# EAGLE design BRD1001-001-010-320 - Clock (EAGLE 9.4.2)
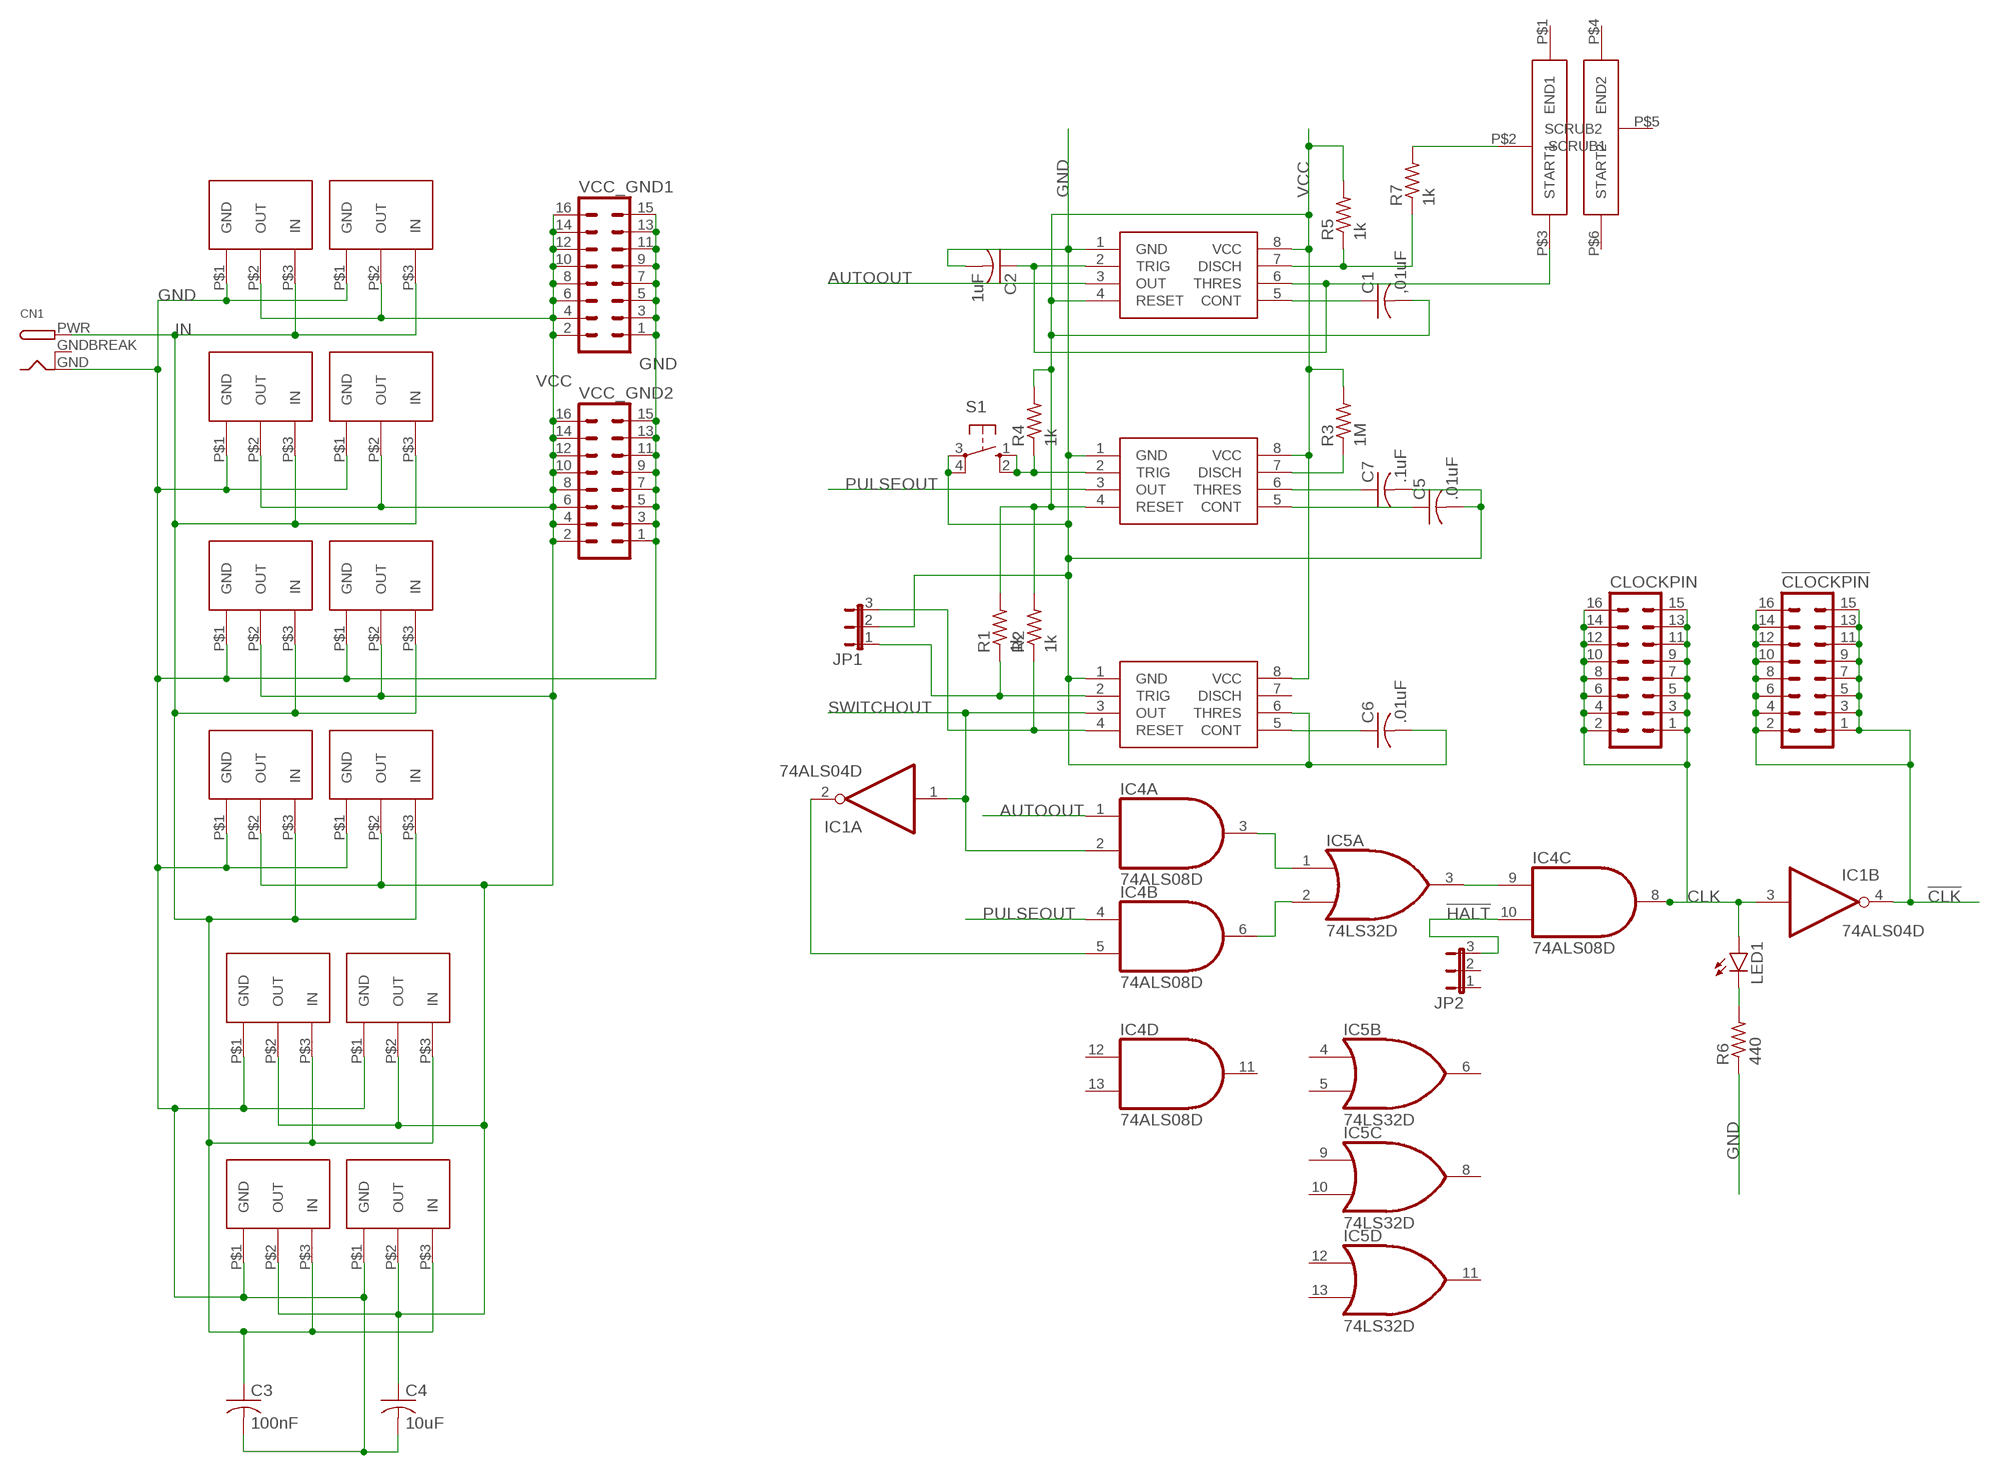
[diagram p0: schematic, sheet 1]

## Parts
!CLOCKPIN  ML16  [ML16]
AUTO  NA555  [SO8]
C1  ,01uF  C-US025-024X044  [C025-024X044]
C2  1uF  C-US025-024X044  [C025-024X044]
C3  100nF  C-US025-024X044  [C025-024X044]
C4  10uF  C-US025-024X044  [C025-024X044]
C5  .01uF  C-US025-024X044  [C025-024X044]
C6  .01uF  C-US025-024X044  [C025-024X044]
C7  .1uF  C-US025-024X044  [C025-024X044]
CLOCKPIN  ML16  [ML16]
CN1  DCBARRELPTH  [DCJACK_2MM_PTH]
IC1  74ALS04D  [SO14]
IC4  74ALS08D  [SO14]
IC5  74LS32D  [SO14]
JP1  JP2E  [JP2]
JP2  JP2E  [JP2]
LED1  LED5MM  [LED5MM]
PULSE  NA555  [SO8]
R1  1k  R-US_0204/2V  [0204V]
R2  1k  R-US_0204/2V  [0204V]
R3  1M  R-US_0204/2V  [0204V]
R4  1k  R-US_0204/2V  [0204V]
R5  1k  R-US_0204/2V  [0204V]
R6  440  R-US_0204/2V  [0204V]
R7  1k  R-US_0204/2V  [0204V]
S1  40-XX  [B3F-40XX]
SWITCH  NA555  [SO8]
U$1  3310H-001-105L  [3310H-001-105L]
U$2  LD1117S33TR  [AZ1117E]
U$3  LD1117S33TR  [AZ1117E]
U$4  LD1117S33TR  [AZ1117E]
U$5  LD1117S33TR  [AZ1117E]
U$6  LD1117S33TR  [AZ1117E]
U$7  LD1117S33TR  [AZ1117E]
U$8  LD1117S33TR  [AZ1117E]
U$9  LD1117S33TR  [AZ1117E]
U$10  LD1117S33TR  [AZ1117E]
U$11  LD1117S33TR  [AZ1117E]
U$12  LD1117S33TR  [AZ1117E]
U$13  LD1117S33TR  [AZ1117E]
VCC_GND1  ML16  [ML16]
VCC_GND2  ML16  [ML16]

## Nets
!CLK: !CLOCKPIN.1 !CLOCKPIN.2 !CLOCKPIN.3 !CLOCKPIN.4 !CLOCKPIN.5 !CLOCKPIN.6 !CLOCKPIN.7 !CLOCKPIN.8 !CLOCKPIN.9 !CLOCKPIN.10 !CLOCKPIN.11 !CLOCKPIN.12 !CLOCKPIN.13 !CLOCKPIN.14 !CLOCKPIN.15 !CLOCKPIN.16 IC1.4(B:O)
!HALT: IC4.10(C:I1) JP2.3
AUTOOUT: AUTO.3(OUT) IC4.1(A:I0)
CLK: CLOCKPIN.1 CLOCKPIN.2 CLOCKPIN.3 CLOCKPIN.4 CLOCKPIN.5 CLOCKPIN.6 CLOCKPIN.7 CLOCKPIN.8 CLOCKPIN.9 CLOCKPIN.10 CLOCKPIN.11 CLOCKPIN.12 CLOCKPIN.13 CLOCKPIN.14 CLOCKPIN.15 CLOCKPIN.16 IC1.3(B:I) IC4.8(C:O) LED1.A
GND [power]: AUTO.1(GND) C2.2 C3.2 C4.2 C5.2 C6.2 C7.2 CN1.GND JP1.2 PULSE.1(GND) R6.1 S1.3(P) S1.4(P1) SWITCH.1(GND) SWITCH.6(THRES) U$2.P$1(GND) U$3.P$1(GND) U$4.P$1(GND) U$5.P$1(GND) U$6.P$1(GND) U$7.P$1(GND) U$8.P$1(GND) U$9.P$1(GND) U$10.P$1(GND) U$11.P$1(GND) U$12.P$1(GND) U$13.P$1(GND) VCC_GND1.1 VCC_GND1.3 VCC_GND1.5 VCC_GND1.7 VCC_GND1.9 VCC_GND1.11 VCC_GND1.13 VCC_GND1.15 VCC_GND2.1 VCC_GND2.3 VCC_GND2.5 VCC_GND2.7 VCC_GND2.9 VCC_GND2.11 VCC_GND2.13 VCC_GND2.15
IN [power]: C3.1 CN1.PWR U$2.P$3(IN) U$3.P$3(IN) U$4.P$3(IN) U$5.P$3(IN) U$6.P$3(IN) U$7.P$3(IN) U$8.P$3(IN) U$9.P$3(IN) U$10.P$3(IN) U$11.P$3(IN) U$12.P$3(IN) U$13.P$3(IN)
N$1: AUTO.2(TRIG) AUTO.6(THRES) C2.1 U$1.P$3(START1)
N$3: LED1.K(C) R6.2
N$4: AUTO.5(CONT) C1.1
N$5: R7.2 U$1.P$2(SCRUB1)
N$6: AUTO.7(DISCH) R5.1 R7.1
N$7: PULSE.2(TRIG) R4.1 S1.1(S) S1.2(S1)
N$8: C7.1 PULSE.6(THRES)
N$9: C5.1 PULSE.5(CONT)
N$10: PULSE.7(DISCH) R3.1
N$11: C6.1 SWITCH.5(CONT)
N$13: JP1.3 R2.1 SWITCH.4(RESET)
N$14: JP1.1 R1.1 SWITCH.2(TRIG)
N$15: IC1.2(A:O) IC4.5(B:I1)
N$16: IC4.3(A:O) IC5.1(A:I0)
N$17: IC4.6(B:O) IC5.2(A:I1)
N$22: IC4.9(C:I0) IC5.3(A:O)
PULSEOUT: IC4.4(B:I0) PULSE.3(OUT)
SWITCHOUT: IC1.1(A:I) IC4.2(A:I1) SWITCH.3(OUT)
VCC [power]: AUTO.4(RESET) AUTO.8(VCC) C1.2 C4.1 PULSE.4(RESET) PULSE.8(VCC) R1.2 R2.2 R3.2 R4.2 R5.2 SWITCH.8(VCC) U$2.P$2(OUT) U$3.P$2(OUT) U$4.P$2(OUT) U$5.P$2(OUT) U$6.P$2(OUT) U$7.P$2(OUT) U$8.P$2(OUT) U$9.P$2(OUT) U$10.P$2(OUT) U$11.P$2(OUT) U$12.P$2(OUT) U$13.P$2(OUT) VCC_GND1.2 VCC_GND1.4 VCC_GND1.6 VCC_GND1.8 VCC_GND1.10 VCC_GND1.12 VCC_GND1.14 VCC_GND1.16 VCC_GND2.2 VCC_GND2.4 VCC_GND2.6 VCC_GND2.8 VCC_GND2.10 VCC_GND2.12 VCC_GND2.14 VCC_GND2.16
Unconnected: IC1.5(C:I) IC1.6(C:O) IC1.8(D:O) IC1.9(D:I) IC1.10(E:O) IC1.11(E:I) IC1.12(F:O) IC1.13(F:I) IC4.11(D:O) IC4.12(D:I0) IC4.13(D:I1) IC5.4(B:I0) IC5.5(B:I1) IC5.6(B:O) IC5.8(C:O) IC5.9(C:I0) IC5.10(C:I1) IC5.11(D:O) IC5.12(D:I0) IC5.13(D:I1) JP2.1 JP2.2 SWITCH.7(DISCH) U$1.P$1(END1) U$1.P$4(END2) U$1.P$5(SCRUB2) U$1.P$6(START2)

## Power pins joined to a net without a drawn wire
GND: IC1.7(P:GND) IC4.7(P:GND) IC5.7(P:GND)
GNDBREAK: CN1.GNDBREAK
VCC: IC1.14(P:VCC) IC4.14(P:VCC) IC5.14(P:VCC)

## Library data of the parts
!CLOCKPIN CLOCKPIN VCC_GND1 VCC_GND2 = con-harting-ml:ML16: HARTING; OC_FARNELL: unknown; OC_NEWARK: unknown
AUTO PULSE SWITCH = 16bit:NA555
C1-C7 = rcl:C-US: CAPACITOR, American symbol; SPICEPREFIX: C
CN1 = adafruit:DCBARREL: 2.0mm DC Barrel Jack DCJACK_2MM_PTH - Through Hole Jack (4UConnector: 05537)
IC1 = 74xx-us:74*04: Hex INVERTER
IC4 = 74xx-us:74*08: Quad 2-input AND gate
IC5 = 74xx-us:74*32: Quad 2-input OR gate
JP1 JP2 = jumper:JP2E: JUMPER
LED1 = led:LED: LED OSRAM: - CHIPLED LG R971, LG N971, LY N971, LG Q971, LY Q971, LO R971, LY R971 LH N974, LH R974 LS Q976, LO Q976, LY Q976 LO Q996 - Hyper CHIPLED LW Q18S LB Q993, LB Q99A, LB R99A - SideLED LS A670, LO A670, LY A670, LG A670, LP A670 LB A673, LV A673, LT A673, LW A673 LH A674 LY A675 LS A676, LA A676, LO A676, LY A676, LW A676 LS A679, LY A679, LG A679 - Hyper Micro SIDELED® LS Y876, LA Y876, LO Y876, LY Y876 LT Y87S - SmartLED LW L88C, LW L88S LB L89C, LB L89S, LG L890 LS L89K, LO L89K, LY L89K LS L896, LA L896, LO L896, LY L896 - TOPLED LS T670, LO T670, LY T670, LG T670, LP T670 LSG T670, LSP T670, LSY T670, LOP T670, LYG T670 LG T671, LOG T671, LSG T671 LB T673, LV T673, LT T673, LW T673 LH T674 LS T676, LA T676, LO T676, LY T676, LB T676, LH T676, LSB T676, LW T676 LB T67C, LV T67C, LT T67C, LS T67K, LO T67K, LY T67K, LW E67C LS E67B, LA E67B, LO E67B, LY E67B, LB E67C, LV E67C, LT E67C LW T67C LS T679, LY T679, LG T679 LS T770, LO T770, LY T770, LG T770, LP T770 LB T773, LV T773, LT T773, LW T773 LH T774 LS E675, LA E675, LY E675, LS T675 LS T776, LA T776, LO T776, LY T776, LB T776 LHGB T686 LT T68C, LB T68C - Hyper Mini TOPLED® LB M676 - Mini TOPLED Santana® LG M470 LS M47K, LO M47K, LY M47K Source: http://www.osram.convergy.de LUXEON: - LUMILED® LXK2-PW12-R00, LXK2-PW12-S00, LXK2-PW14-U00, LXK2-PW14-V00 LXK2-PM12-R00, LXK2-PM12-S00, LXK2-PM14-U00 LXK2-PE12-Q00, LXK2-PE12-R00, LXK2-PE12-S00, LXK2-PE14-T00, LXK2-PE14-U00 LXK2-PB12-K00, LXK2-PB12-L00, LXK2-PB12-M00, LXK2-PB14-N00, LXK2-PB14-P00, LXK2-PB14-Q00 LXK2-PR12-L00, LXK2-PR12-M00, LXK2-PR14-Q00, LXK2-PR14-R00 LXK2-PD12-Q00, LXK2-PD12-R00, LXK2-PD12-S00 LXK2-PH12-R00, LXK2-PH12-S00 LXK2-PL12-P00, LXK2-PL12-Q00, LXK2-PL12-R00 Source: www.luxeon.com KINGBRIGHT: KA-3528ASYC Source: www.kingbright.com
R1-R7 = rcl:R-US_: RESISTOR, American symbol; SPICEPREFIX: R
S1 = switch-omron:40-XX: OMRON SWITCH; MF: OMRON COMPONENTS USA; MPN: B3F-4000; OC_FARNELL: 176434; OC_NEWARK: 36K3105
U$1 = 16bit:3310H-001-105L
U$2-U$13 = P1001-001-310 - Eagle Library:LD1117S33TR

## Net classes
1 power: width 1.219 mm

## Board
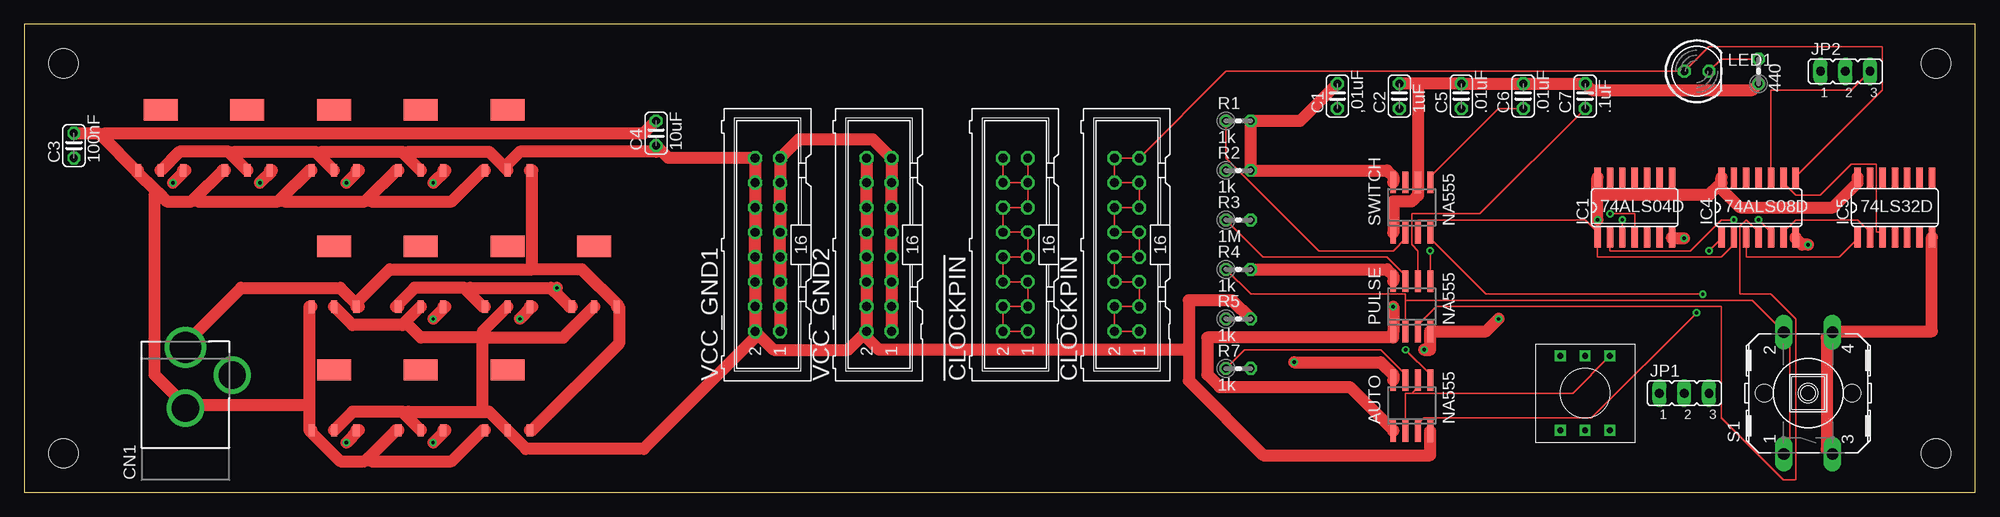
[diagram p1: board, top side]
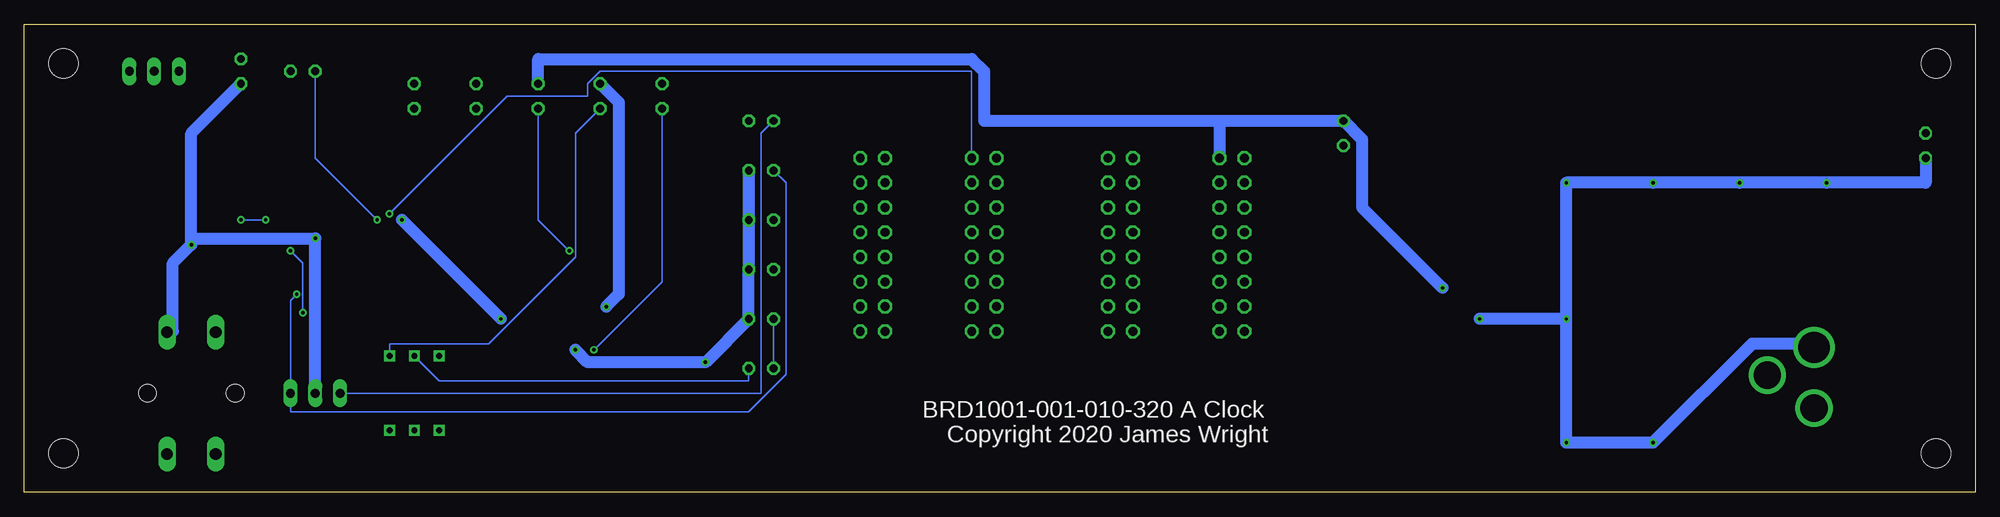
[diagram p2: board, bottom side, seen from below]

Size 200 x 48 mm. Coordinates in mm from the lower left corner, seen from the top.
Outline: 0,0 200,0 200,48 0,48 0,0
Copper layers (1*16): Top 0.035mm / dielectric 1.5mm / Bottom 0.035mm
Design rules "default": minimum track width 6mil, minimum drill 0.35mm, track to track 6mil, track to pad 6mil, pad to pad 6mil, via to via 6mil, smd to smd 6mil, copper to edge 40mil, drill to drill 6mil, minimum pad ring 10mil, minimum via ring 8mil, stop-mask expansion 4mil, vias tented up to drill 0mil, thermal gap 10mil
Holes 3 mm at 4,4 196,44 4,44 196,4

### Footprints (pad centres in the part's own frame; a part is rotated, then mirrored left to right if it is on the bottom)
ML16 = drill 0.914 octagon: 1 -8.89,-1.27; 2 -8.89,1.27; 3 -6.35,-1.27; 4 -6.35,1.27; 5 -3.81,-1.27; 6 -3.81,1.27; 7 -1.27,-1.27; 8 -1.27,1.27; 9 1.27,-1.27; 10 1.27,1.27; 11 3.81,-1.27; 12 3.81,1.27; 13 6.35,-1.27; 14 6.35,1.27; 15 8.89,-1.27; 16 8.89,1.27
SO8 = smd 0.6 x 2.2: 1 -1.905,-2.6; 2 -0.635,-2.6; 3 0.635,-2.6; 4 1.905,-2.6; 5 1.905,2.6; 6 0.635,2.6; 7 -0.635,2.6; 8 -1.905,2.6
C025-024X044 = drill 0.813 octagon: 1 -1.27,0; 2 1.27,0
DCJACK_2MM_PTH = drill 2.8: GND 0,7.35; GNDBREAK 4.8,10.75 | drill 3.2: PWR 0,13.6
SO14 = smd 0.66 x 2.032: 1 -3.81,-3.073; 2 -2.54,-3.073; 3 -1.27,-3.073; 4 0,-3.073; 5 1.27,-3.073; 6 2.54,-3.073; 7 3.81,-3.073; 8 3.81,3.073; 9 2.54,3.073; 10 1.27,3.073; 11 0,3.073; 12 -1.27,3.073; 13 -2.54,3.073; 14 -3.81,3.073
JP2 = drill 0.914 long: 1 -2.54,0; 2 0,0; 3 2.54,0
LED5MM = drill 0.813 octagon: A -1.27,0; K 1.27,0
0204V = drill 0.813 octagon: 1 -1.27,0; 2 1.27,0
B3F-40XX = drill 1.194 long: 1 -6.248,2.489; 2 6.248,2.489; 3 -6.248,-2.489; 4 6.248,-2.489 | hole 1.803: 0,-4.496; 0,4.496
3310H-001-105L = drill 0.6 square: P$1 -2.54,3.81; P$2 0,3.81; P$3 2.54,3.81; P$4 -2.54,-3.81; P$5 0,-3.81; P$6 2.54,-3.81
AZ1117E = smd 0.635 x 1.27: P$1 -2.3,0; P$2 0,0; P$3 2.3,0 | smd 3.5 x 2.2: P$6 0,6.2

### Placement (x,y rotation side)
!CLOCKPIN  101.6,25.4 90 top
AUTO  142.24,8.89 0 top
C1  134.62,40.64 90 top
C2  140.97,40.64 90 top
C3  5.08,35.56 90 top
C4  64.77,36.83 90 top
C5  147.32,40.64 90 top
C6  153.67,40.64 90 top
C7  160.02,40.64 90 top
CLOCKPIN  113.03,25.4 90 top
CN1  16.51,1.27 0 top
IC1  165.1,29.21 0 top
IC4  177.8,29.21 0 top
IC5  191.77,29.21 0 top
JP1  170.18,10.16 0 top
JP2  186.69,43.18 0 top
LED1  171.45,43.18 0 top
PULSE  142.24,19.05 0 top
R1  124.46,38.1 0 top
R2  124.46,33.02 0 top
R3  124.46,27.94 0 top
R4  124.46,22.86 0 top
R5  124.46,17.78 0 top
R6  177.8,43.18 90 top
R7  124.46,12.7 0 top
S1  182.88,10.16 90 top
SWITCH  142.24,29.21 0 top
U$1  160.02,10.16 0 top
U$2  40.64,6.35 0 top
U$3  49.53,6.35 0 top
U$4  31.75,33.02 0 top
U$5  31.75,19.05 0 top
U$6  31.75,6.35 0 top
U$7  40.64,33.02 0 top
U$8  40.64,19.05 0 top
U$9  49.53,33.02 0 top
U$10  22.86,33.02 0 top
U$11  13.97,33.02 0 top
U$12  49.53,19.05 0 top
U$13  58.42,19.05 0 top
VCC_GND1  76.2,25.4 90 top
VCC_GND2  87.63,25.4 90 top

### Tracks (layer width: path | path; a pad name or v marks a point on that pad's centre or on a via)
!CLK  (via drill 0.35)
  Top 0.152: !CLOCKPIN.1 !CLOCKPIN.2 !CLOCKPIN.4 !CLOCKPIN.3 !CLOCKPIN.5 !CLOCKPIN.6 !CLOCKPIN.8 !CLOCKPIN.7 !CLOCKPIN.9 !CLOCKPIN.10 !CLOCKPIN.12 !CLOCKPIN.11 !CLOCKPIN.13 | !CLOCKPIN.16 !CLOCKPIN.14 !CLOCKPIN.13 | IC1.4 165.1,28.57 v162.56,28.57 | !CLOCKPIN.15 !CLOCKPIN.13
  Bottom 0.152: v162.56,28.57 150.5,40.64 142.24,40.64 142.24,41.91 140.97,43.18 102.87,43.18 !CLOCKPIN.15
!HALT
  Top 0.152: IC4.10 179.07,41.27 187.32,41.27 JP2.3
AUTOOUT  (via drill 0.35)
  Top 0.152: v172.72,24.77 173.99,26.04 IC4.1 | v171.45,18.41 160.66,7.62 143.51,7.62 142.88,6.99 AUTO.3
  Bottom 0.152: v172.72,24.77 171.45,23.5 v171.45,18.41
CLK  (via drill 0.35)
  Top 0.152: CLOCKPIN.1 CLOCKPIN.2 CLOCKPIN.4 CLOCKPIN.3 CLOCKPIN.5 CLOCKPIN.6 CLOCKPIN.8 CLOCKPIN.7 CLOCKPIN.9 CLOCKPIN.10 CLOCKPIN.12 CLOCKPIN.11 CLOCKPIN.13 CLOCKPIN.14 CLOCKPIN.16 CLOCKPIN.15 123.19,43.18 LED1.A 172.72,45.72 190.5,45.72 190.5,41.27 181.61,32.38 IC4.8 | v163.83,27.94 IC1.3
  Bottom 0.152: v163.83,27.94 170.18,34.29 LED1.A
GND  (via drill 0.35)
  Top 1.219: 29.21,8.89 29.21,19.05 U$5.P$1 | 29.21,8.89 29.21,6.35 | 35.24,3.49 34.92,3.17 32.38,3.17 29.21,6.35 | 35.24,3.49 38.1,6.35 U$2.P$1 | 29.21,6.35 U$6.P$1 | U$3.P$1 46.99,6.35 43.81,3.17 35.56,3.17 35.24,3.49 | 29.21,8.89 16.51,8.89 | 45.4,20.64 46.99,19.05 U$12.P$1 | 45.4,20.64 45.09,20.95 40.01,20.95 38.1,19.05 U$8.P$1 | 54.29,20.64 53.98,20.95 45.72,20.95 45.4,20.64 | 54.29,20.64 55.88,19.05 U$13.P$1 | 7.94,36.51 7.62,36.83 C3.2 | 7.94,36.51 11.43,33.02 | 17.46,30.16 17.14,29.84 14.61,29.84 13.65,30.8 | 17.46,30.16 20.32,33.02 U$10.P$1 | 11.43,33.02 13.65,30.8 | 11.43,33.02 U$11.P$1 | 26.35,30.16 26.04,29.84 17.78,29.84 17.46,30.16 | 26.35,30.16 29.21,33.02 U$4.P$1 | 35.24,30.16 34.92,29.84 26.67,29.84 26.35,30.16 | 35.24,30.16 38.1,33.02 U$7.P$1 | U$9.P$1 46.99,33.02 43.81,29.84 35.56,29.84 35.24,30.16 | C4.2 63.5,36.83 8.26,36.83 7.94,36.51 | v54.61,20.95 54.29,20.64 | 16.51,8.89 13.34,12.06 13.34,30.48 13.65,30.8 | 16.51,8.89 CN1.GND | v170.18,26.04 168.91,26.04 IC1.7 | v182.88,25.4 182.25,25.4 181.61,26.04 IC4.7 | IC5.7 195.58,16.51 185.42,16.51 S1.4 184.78,15.88 184.78,4.45 S1.3 | AUTO.1 140.34,6.35 135.89,10.79 122.56,10.79 121.28,12.06 121.28,15.88 140.34,15.88 PULSE.1 v140.34,19.05 | SWITCH.1 140.34,29.84 142.24,29.84 142.88,30.48 SWITCH.6 142.88,41.91 | 142.88,41.91 C5.2 C6.2 C7.2 160.66,41.27 177.16,41.27 R6.1 | 142.88,41.91 C2.2 | VCC_GND1.1 VCC_GND1.3 VCC_GND1.5 VCC_GND1.7 VCC_GND1.9 VCC_GND1.11 VCC_GND1.13 VCC_GND1.15 79.38,36.2 87,36.2 VCC_GND2.15 VCC_GND2.13 VCC_GND2.11 VCC_GND2.9 VCC_GND2.7 VCC_GND2.5 VCC_GND2.3 VCC_GND2.1
  Bottom 1.219: v54.61,20.95 62.87,29.21 62.87,36.2 C4.2 77.47,38.1 | JP1.2 v170.18,26.04 182.88,26.04 | S1.4 184.78,16.51 184.78,23.5 v182.88,25.4 182.88,26.04 | R6.1 182.88,36.83 182.88,26.04 | v140.34,19.05 139.06,20.32 139.06,40.01 C2.2 | 77.47,38.1 101.6,38.1 101.6,43.18 102.87,44.45 147.32,44.45 C5.2 | 77.47,38.1 VCC_GND1.15
IN  (via drill 0.35)
  Top 1.219: v15.24,31.75 16.51,33.02 U$11.P$3 | v24.13,31.75 25.4,33.02 U$10.P$3 | v33.02,31.75 34.29,33.02 U$4.P$3 | v41.91,31.75 43.18,33.02 U$7.P$3 | 60.96,19.05 60.96,15.24 52.07,6.35 U$3.P$3 | 52.07,22.86 52.07,33.02 U$9.P$3 | 52.07,22.86 57.15,22.86 60.96,19.05 | 60.96,19.05 U$13.P$3 | v33.02,5.08 34.29,6.35 U$6.P$3 | 33.97,19.37 32.38,20.95 22.23,20.95 16.51,15.24 CN1.PWR | 33.97,19.37 34.29,19.05 U$5.P$3 | v41.91,5.08 43.18,6.35 U$2.P$3 | v41.91,17.78 43.18,19.05 U$8.P$3 | v50.8,17.78 52.07,19.05 U$12.P$3 | 52.07,22.86 37.47,22.86 33.97,19.37
  Bottom 1.219: C3.1 5.08,31.75 v15.24,31.75 v24.13,31.75 v33.02,31.75 v41.91,31.75 v41.91,17.78 | CN1.PWR 16.51,15.24 22.86,15.24 v33.02,5.08 v41.91,5.08 v41.91,17.78 | v41.91,17.78 v50.8,17.78
N$1
  Top 0.152: AUTO.2 141.6,10.16 142.24,10.16 | 142.24,10.16 142.88,10.79 AUTO.6 | U$1.P$3 158.75,10.16 142.24,10.16
  Bottom 0.152: C2.1 143.51,36.83 143.51,24.13 152.4,15.24 162.56,15.24 U$1.P$3
N$3
  Top 0.152: LED1.K 173.99,44.45 R6.2
N$4  (via drill 0.35)
  Top 0.152: v141.6,14.61 144.15,12.06 AUTO.5
  Bottom 0.152: v141.6,14.61 134.62,21.59 C1.1
N$5
  Bottom 0.152: U$1.P$2 157.48,11.43 125.73,11.43 R7.2
N$6
  Top 0.152: R7.1 125.09,14.61 139.06,14.61 141.6,12.06 AUTO.7
  Bottom 0.152: R7.1 R5.1
N$7
  Top 0.152: S1.1 180.97,4.45 180.97,15.88 S1.2 180.34,16.51 177.16,19.68 141.6,19.68 | 141.6,19.68 141.6,20.32 125.73,20.32 R4.1 | 141.6,19.68 PULSE.2
N$8
  Top 0.152: PULSE.6 142.88,24.77 142.24,25.4 142.24,28.57 149.22,28.57 C7.1
N$9  (via drill 0.35)
  Top 0.152: v144.15,24.77 PULSE.5
  Bottom 0.152: v144.15,24.77 147.32,27.94 C5.1
N$10
  Top 0.152: R3.1 127,24.13 139.7,24.13 141.6,22.23 PULSE.7
N$11
  Top 0.152: C6.1 151.13,39.37 144.15,32.38 SWITCH.5
N$13  (via drill 0.35)
  Top 0.152: v172.09,20.32 149.86,20.32 144.15,26.04 SWITCH.4
  Bottom 0.152: v172.09,20.32 172.72,19.68 JP1.3 172.72,8.26 125.73,8.26 121.92,12.06 121.92,31.75 R2.1
N$14
  Top 0.152: R1.1 123.19,34.29 132.72,24.77 140.34,24.77 141.6,26.04 SWITCH.2
  Bottom 0.152: JP1.1 124.46,10.16 124.46,36.83 R1.1
N$15  (via drill 0.35)
  Top 0.152: IC1.2 162.56,24.77 170.81,24.77 173.99,27.94 v175.26,27.94 | v177.8,27.94 179.07,26.67 IC4.5
  Bottom 0.152: v177.8,27.94 v175.26,27.94
N$16
  Top 0.152: IC4.3 176.53,24.13 186.06,24.13 187.96,26.04 IC5.1
N$17
  Top 0.152: IC4.6 180.34,26.67 181.61,27.94 187.96,27.94 189.23,26.67 IC5.2
N$22
  Top 0.152: IC4.9 180.34,31.75 181.61,30.48 184.15,30.48 187.32,33.66 189.87,33.66 189.87,26.67 190.5,26.67 IC5.3
PULSEOUT
  Top 0.152: PULSE.3 142.88,17.14 144.78,19.05 173.99,19.05 173.99,7.62 180.34,1.27 181.61,1.27 181.61,17.78 179.07,20.32 175.9,20.32 175.9,27.3 176.53,27.94 177.8,26.67 IC4.4
SWITCHOUT
  Top 0.152: IC4.2 175.26,25.4 173.99,24.13 161.29,24.13 IC1.1 161.29,26.67 160.02,27.94 142.88,27.94 SWITCH.3
VCC  (via drill 0.35)
  Top 1.219: U$5.P$2 33.66,17.14 38.73,17.14 39.05,17.46 | U$8.P$2 39.05,17.46 | U$6.P$2 33.66,8.26 38.73,8.26 39.05,7.94 | U$2.P$2 39.05,7.94 | 46.99,8.26 39.37,8.26 39.05,7.94 | 46.99,8.26 47.62,8.26 U$3.P$2 51.44,4.45 63.5,4.45 74.93,15.88 VCC_GND1.2 | U$12.P$2 46.99,16.51 46.99,15.88 | 46.99,8.26 46.99,15.88 | U$13.P$2 55.24,15.88 46.99,15.88 | 39.05,17.46 40.64,15.88 46.99,15.88 | U$11.P$2 15.88,34.92 20.95,34.92 21.27,34.61 | U$10.P$2 21.27,34.61 | 30.16,34.61 29.84,34.92 21.59,34.92 21.27,34.61 | 30.16,34.61 U$4.P$2 | 39.05,34.61 38.73,34.92 30.48,34.92 30.16,34.61 | 39.05,34.61 U$7.P$2 | 49.21,33.34 47.62,34.92 39.37,34.92 39.05,34.61 | 49.21,33.34 U$9.P$2 | VCC_GND2.16 VCC_GND2.14 VCC_GND2.12 VCC_GND2.10 VCC_GND2.8 VCC_GND2.6 VCC_GND2.4 VCC_GND2.2 | VCC_GND1.2 VCC_GND1.4 VCC_GND1.6 VCC_GND1.8 VCC_GND1.10 VCC_GND1.12 VCC_GND1.14 VCC_GND1.16 66.04,34.29 C4.1 64.77,34.92 50.8,34.92 49.21,33.34 | VCC_GND2.2 84.45,14.61 76.83,14.61 VCC_GND1.2 | R4.2 139.7,22.86 140.34,22.23 PULSE.8 | SWITCH.8 140.34,32.38 139.7,33.02 R2.2 R1.2 130.81,38.1 C1.2 | 161.29,30.48 IC1.14 | 161.29,30.48 172.72,30.48 173.67,31.43 | 173.67,31.43 173.99,31.75 IC4.14 | 173.67,31.43 175.9,29.21 185.42,29.21 187.96,31.75 IC5.14 | AUTO.4 144.15,3.81 127,3.81 119.38,11.43 119.38,14.61 | 119.38,14.61 119.38,19.68 123.83,19.68 R5.2 | v130.18,13.34 139.06,13.34 140.34,12.06 AUTO.8 | v143.51,14.61 144.15,14.61 PULSE.4 144.15,16.51 149.86,16.51 v151.13,17.78 | v161.29,27.94 161.29,30.48 | 119.38,14.61 87.63,14.61 86.36,15.88 VCC_GND2.2
  Bottom 1.219: R2.2 R3.2 R4.2 R5.2 v130.18,13.34 142.24,13.34 v143.51,14.61 | v151.13,17.78 v161.29,27.94

### Text on the board
bPlace: BRD1001-001-010-320 A Clock | Copyright 2020 James Wright